# EAGLE board CrowBot -V1.4-20220909 (EAGLE 9.5.1), part 1 of 2
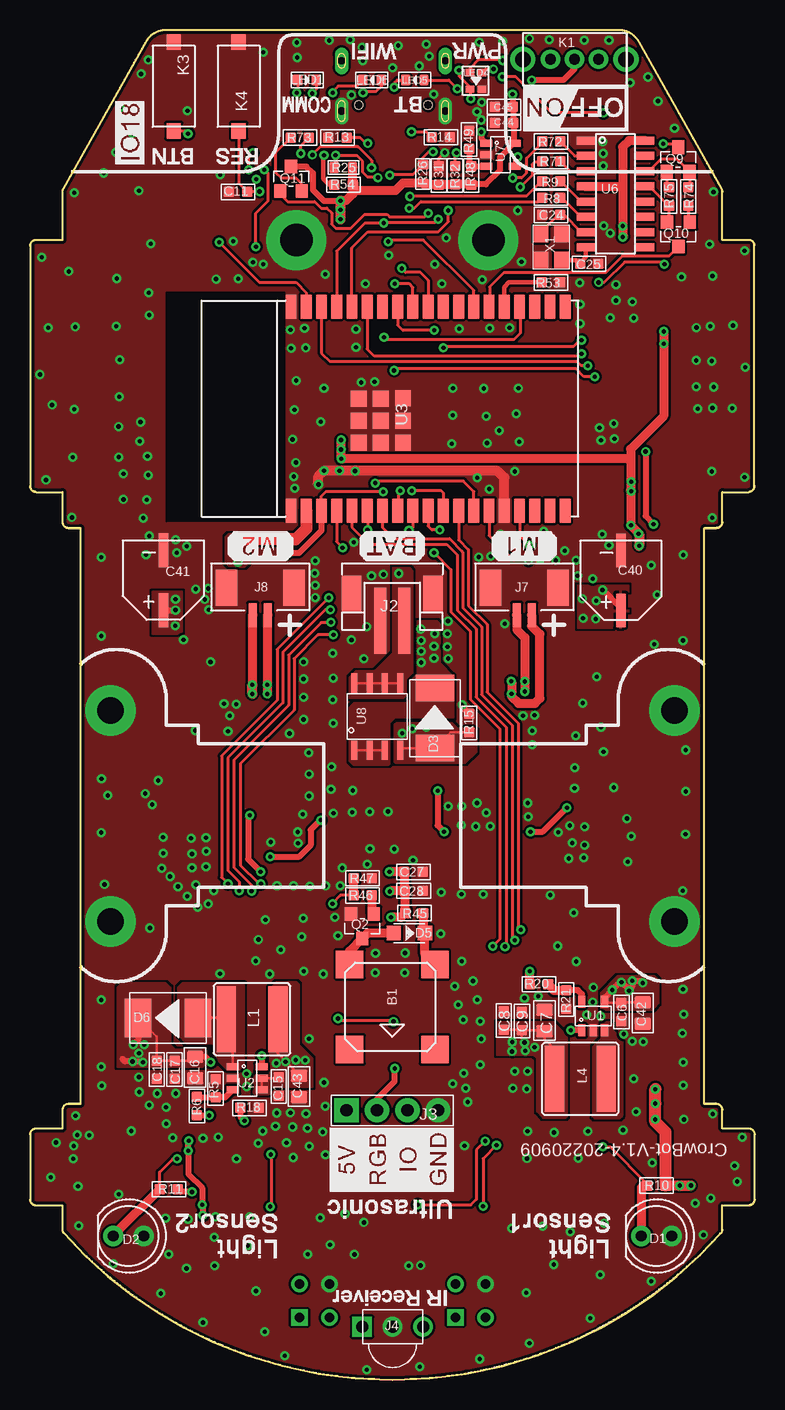
[diagram p5: board, top side]
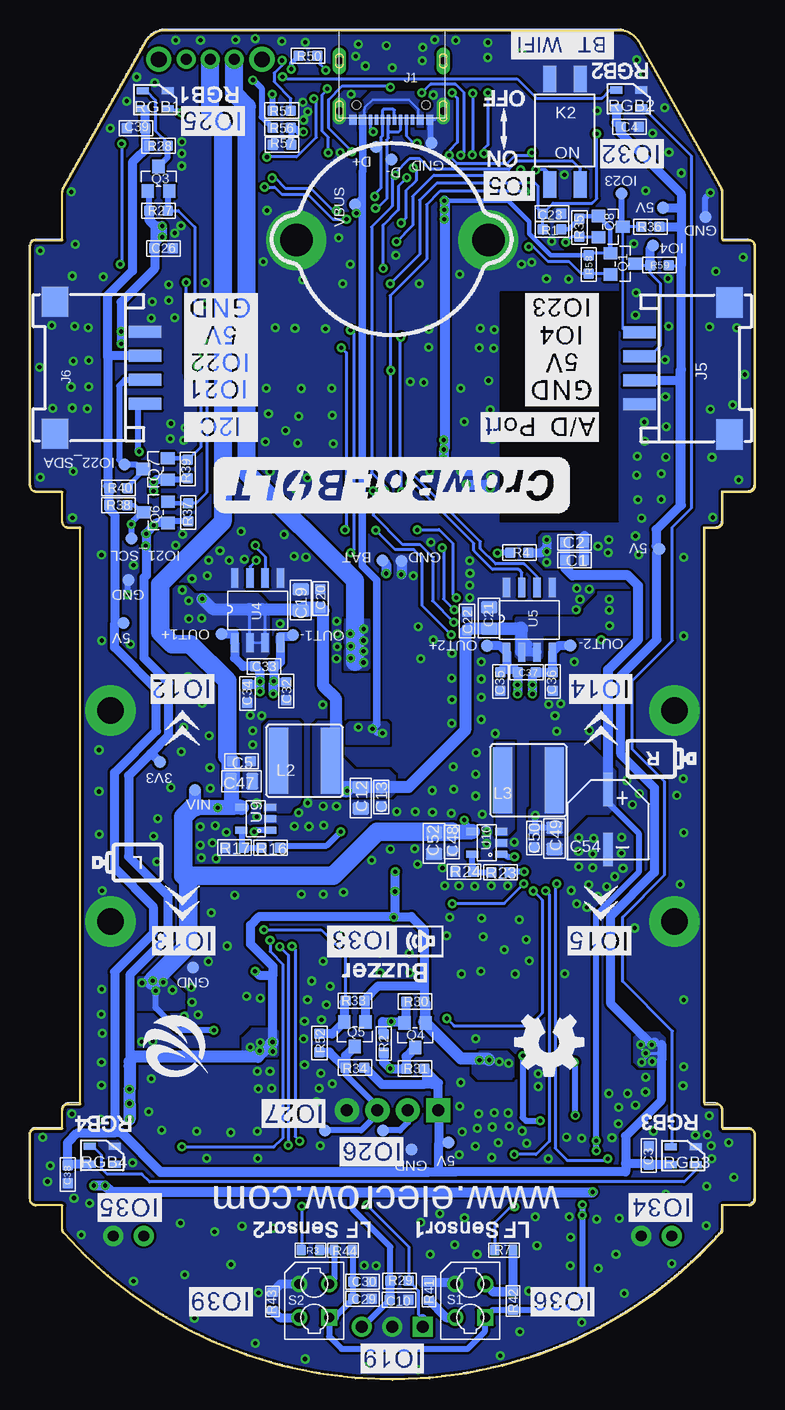
[diagram p6: board, bottom side, seen from below]

Size 60.4 x 112.49 mm. Coordinates in mm from the lower left corner, seen from the top.
Outline: 9.63,111.47 2.76,99.24 arc29 2.7,99 2.7,94.99 0.5,94.99 arc90 0,94.49 0,74.49 arc90 0.5,73.99 2.7,73.99 2.7,71.49 arc90 3.2,70.99 4.2,70.99 4.2,22.99 3.2,22.99 arc90 2.7,22.49 2.7,20.94 0.5,20.94 arc90 0,20.44 0,15.04 arc90 0.5,14.54 2.7,14.54 2.7,12.54 arc35 2.79,12.24 arc24 15.19,3.2 arc48 45.2,3.19 arc24 57.61,12.25 arc35 57.7,12.54 57.7,14.54 59.9,14.54 arc90 60.4,15.04 60.4,20.44 arc90 59.9,20.94 57.7,20.94 57.7,22.49 arc90 57.2,22.99 56.2,22.99 56.2,70.99 57.2,70.99 arc90 57.7,71.49 57.7,73.99 59.9,73.99 arc90 60.38,74.52 60.38,94.52 arc90 59.9,94.99 57.7,94.99 57.7,99 arc29 57.64,99.24 50.77,111.47 arc61 49.03,112.49 11.37,112.49 arc61 9.63,111.47
Copper layers (1*16): Top 0.035mm / dielectric 1.5mm / Bottom 0.035mm
Design rules "default *": minimum track width 6mil, minimum drill 0.35mm, track to track 8mil, track to pad 7mil, pad to pad 7mil, via to via 8mil, smd to smd 8mil, copper to edge 10mil, drill to drill 8mil, minimum pad ring 10mil, minimum via ring 8mil, stop-mask expansion 4mil, vias tented up to drill 100mil, thermal gap 10mil
Net classes: 0 default: width 0.203 mm, drill 0.178 mm, clearance 0.178 mm
tRestrict: area 11.4,71.5 to 21.2,90.6
bRestrict: area 11.4,71.5 to 21.2,90.6

## Footprints (pad centres in the part's own frame; a part is rotated, then mirrored left to right if it is on the bottom)
MLT-8530 = smd 2.3 x 2.3: 1 -3.55,3.55; 2 -3.55,-3.55; 3 3.55,-3.55; 4 3.55,3.55
DISCRETE_C0603 = smd 0.889 x 0.889: 1 -0.762,0; 2 0.762,0
0603 = smd 0.889 x 0.889: 1 -0.762,0; 2 0.762,0
0805 = smd 1.016 x 1.397: 1 -0.889,0; 2 0.889,0
CAP_220UF_SMD_6.3*5.4MM = smd 0.8 x 2.8: 1+ 0,2.5; 2- 0,-2.5
CAP-100UF-SMD-6.3*4.5MM = smd 0.8 x 2.8: 1+ 0,2.5; 2- 0,-2.5
LIGHT-PD-F5MM = drill 0.9 pad 1.676: 1 -1.27,0; 2 1.27,0
214AB = smd 2.2 x 3.2: 1 -2.5,0; 2 2.5,0
SOD-323 = smd 1.2 x 1.2: 1 1.3,0; 2 -1.3,0
TYPEC-3.0-16P-SMD = smd 0.3 x 0.85: A1 -3.35,0; A4 -2.55,0; A5 -1.25,0; A6 -0.25,0; A7 0.25,0; A8 -1.75,0; A9 2.55,0; A12 3.35,0; B1 3.05,0; B4 2.25,0; B5 1.75,0; B6 0.75,0; B7 -0.75,0; B8 1.25,0; B9 -2.25,0; B12 -3.05,0 | drill 0.6 pad 1.016 long: P$1 -4.325,-0.72; P$2 4.325,-0.72; P$3 -4.325,-4.9; P$4 4.325,-4.9 | hole 0.68: -2.89,-1.22; 2.89,-1.22
PH2.0_2P = smd 1 x 5.5: 1 -1,2.75; 2 1,2.75 | smd 1.6 x 3: 3 -3.4,0.5; 4 3.4,0.5
4P-2.54-80/40MIL = drill 1.016 pad 2.032 square: 1 0,3.81 | drill 1.016 pad 2.032: 2 0,1.27; 3 0,-1.27; 4 0,-3.81
3P-2.54-4.8X5X6.95H = drill 1 pad 1.65 square: 1 -2.54,0 | drill 1 pad 1.65: 2 0,0; 3 2.54,0
CONNECTOR_4P-SMD-2.0-90D = smd 1.01 x 2.74: 1 -3,-0.1; 2 -1,-0.1; 3 1,-0.1; 4 3,-0.1 | smd 2.54 x 2.184: SS1 -5.5,7.4; SS2 5.5,7.4
CROWBOT-V1.0库_1.25MM-2PIN = smd 0.7 x 2: 1+ -0.625,2.3; 2 0.625,2.3 | smd 1.8 x 3: 3 -2.8,0; 4 2.8,0
SWITCH-8.9*6.9*4.7MM = drill 0.9 pad 1.6: 1 -2.01,0; 2 -0.01,0; 3 1.99,0 | drill 1.3 pad 2.1: P$1 -4.31,0; P$2 4.29,0
KEY_BM_4PIN = smd 1.1 x 2.2: 1 -1.27,3.81; 2 -1.27,-4.99; 3 1.27,3.81; 4 1.27,-4.99
CROWBOT-V1.1库_KEY_EN_2PIN_B/W = smd 1.3 x 1.2: 1 -3.7,0; 2 3.7,0
CD54 = smd 5.5 x 1.6: 1 0,2.159; 2 0,-2.159
DISCRETE_LED-0603 = smd 0.762 x 0.889: + -0.762,0; - 0.762,0
LED_BOTH_RED_BLUE_SMD_1.6*1.6*0.6MM = smd 0.6 x 0.7: 1 -0.635,0.635; 2 0.765,0.635; 3 -0.635,-0.365; 4 0.765,-0.365
PAD-1.0MM = smd 1 x 1: P$1 0,0
SOT23 = smd 1.016 x 1.143: 1 -0.889,-1.016; 2 0.889,-1.016; 3 0,1.016
SOT23@1 = smd 1.016 x 1.143: 1 -0.95,-1.016; 2 0.95,-1.016; 3 0,1.016
DISCRETE_R0603 = smd 0.889 x 0.889: 1 -0.762,0; 2 0.762,0
0603_S = smd 0.762 x 0.889: 1 -0.762,0; 2 0.762,0
R0603 = smd 0.889 x 0.889: 1 -0.762,0; 2 0.762,0
LED-RGB-4P-SMD-2427 = smd 1 x 0.6: 1_DOUT 1,-0.7; 2_GND 1,0.8; 3_DIN -1.1,0.8; 4_VCC -1.1,-0.7
4P-6.4X4.9X6.5H = drill 0.8 pad 1.35 square: 1 -1.4,-1.25 | drill 0.8 pad 1.35: 2 -1.4,1.25; 3 1.4,-1.25; 4 1.4,1.25
A_XBJ_SOT23-5 = smd 0.6 x 1: 1 -0.95,-1.2; 2 0,-1.2; 3 0.95,-1.2; 4 0.95,1.2; 5 -0.95,1.2
A_XBJ_SOT23-6 = smd 0.6 x 1: 1 -0.95,-1.2; 2 0,-1.2; 3 0.95,-1.2; 4 0.95,1.2; 5 0,1.2; 6 -0.95,1.2
ESP32-WROVER-B = smd 2 x 0.9: 1 -8.5,23.96; 2 -8.5,22.69; 3 -8.5,21.42; 4 -8.5,20.15; 5 -8.5,18.88; 6 -8.5,17.61; 7 -8.5,16.34; 8 -8.5,15.07; 9 -8.5,13.8; 10 -8.5,12.53; 11 -8.5,11.26; 12 -8.5,9.99; 13 -8.5,8.72; 14 -8.5,7.45; 15 -8.5,6.18; 16 -8.5,4.91; 17 -8.5,3.64; 18 -8.5,2.37; 19 -8.5,1.1; 20 8.5,1.1; 21 8.5,2.37; 22 8.5,3.64; 23 8.5,4.91; 24 8.5,6.18; 25 8.5,7.45; 26 8.5,8.72; 27 8.5,9.99; 28 8.5,11.26; 29 8.5,12.53; 30 8.5,13.8; 31 8.5,15.07; 32 8.5,16.34; 33 8.5,17.61; 34 8.5,18.88; 35 8.5,20.15; 36 8.5,21.42; 37 8.5,22.69; 38 8.5,23.96 | smd 1.33 x 1.33: 39 -2.835,18.295; 40 -1,18.295; 41 0.835,18.295; 42 -2.835,16.46; 43 -1,16.46; 44 0.835,16.46; 45 -2.835,14.625; 46 -1,14.625; 47 0.85,14.625
L9110S/SOP8 = smd 0.61 x 1.6: 1 -1.905,-2.7; 2 -0.635,-2.7; 3 0.635,-2.7; 4 1.905,-2.7; 5 1.905,2.7; 6 0.635,2.7; 7 -0.635,2.7; 8 -1.905,2.7
SOP-16 = smd 0.66 x 1.5: 1 -4.445,-2.475; 2 -3.175,-2.475; 3 -1.905,-2.475; 4 -0.635,-2.475; 5 0.635,-2.475; 6 1.905,-2.475; 7 3.175,-2.475; 8 4.445,-2.475; 9 4.445,2.475; 10 3.175,2.475; 11 1.905,2.475; 12 0.635,2.475; 13 -0.635,2.475; 14 -1.905,2.475; 15 -3.175,2.475; 16 -4.445,2.475
ME321AM5G-SOT23-5 = smd 0.6 x 1: 1 -0.95,-1.2; 2 0,-1.2; 3 0.95,-1.2; 4 0.95,1.2; 5 -0.95,1.2
SOP8 = smd 0.5 x 1.6: P$1 -1.905,-2.8; P$2 -0.635,-2.8; P$3 0.635,-2.8; P$4 1.905,-2.8; P$5 1.905,2.8; P$6 0.635,2.8; P$7 -0.635,2.8; P$8 -1.905,2.8
SMD3225 = smd 1.4 x 1.2: 1 -1.1,-0.85; 2 1.1,-0.85; 3 1.1,0.85; 4 -1.1,0.85

## Placement (x,y rotation side)
B1  MLT-8530  [MLT-8530]  30.19,31.08 270 top
C1  10uF  [DISCRETE_C0603]  15.03,68.32 180 bottom
C2  100nF  [DISCRETE_C0603]  15.03,69.79 180 bottom
C3  1uF  [DISCRETE_C0603]  8.83,18.69 270 bottom
C4  1uF  [DISCRETE_C0603]  10.43,104.44 180 bottom
C5  1uF  [0603]  42.77,51.55 180 bottom
C6  1uF  [0603]  49.29,30.65 90 top
C7  22uF  [0805]  42.88,29.94 270 top
C8  1uF  [0603]  39.48,29.94 270 top
C9  100nF  [0603]  41,29.92 270 top
C10  100nF  [DISCRETE_C0603]  29.65,6.69 180 bottom
C11  4.7uF  [0603]  17.34,98.99 180 top
C12  22uF  [0805]  32.84,48.51 90 bottom
C13  1uF  [0603]  31.13,48.56 90 bottom
C15  1uF  [0603]  20.74,24.45 90 top
C16  22uF  [0805]  13.76,26.03 90 top
C17  1uF  [0603]  12.04,25.85 90 top
C18  100nF  [0603]  10.56,25.85 90 top
C19  22uF  [0805]  37.83,64.99 270 bottom
C20  100nF  [DISCRETE_C0603]  36.2,65.12 270 bottom
C21  22uF  [0805]  22.14,63.49 270 bottom
C22  100nF  [DISCRETE_C0603]  23.98,63.24 270 bottom
C23  100nF  [DISCRETE_C0603]  16.9,97.2 180 bottom
C24  20pF  [0603]  43.43,97.09 0 top
C25  20pF  [0603]  46.6,93.02 180 top
C26  100nF  [0603]  49.28,94.29 0 bottom
C27  1uF  [DISCRETE_C0603]  31.95,42.33 180 top
C28  100nF  [DISCRETE_C0603]  31.98,40.76 180 top
C29  1uF  [DISCRETE_C0603]  32.7,6.77 180 bottom
C30  1uF  [DISCRETE_C0603]  32.7,8.17 180 bottom
C31  100nF  [DISCRETE_C0603]  34.08,100.38 270 top
C32  1uF  [0603]  39.05,57.4 90 bottom
C33  1uF  [0603]  40.88,59.45 180 bottom
C34  1uF  [0603]  42.28,57.19 90 bottom
C35  1uF  [0603]  21.2,58.21 90 bottom
C36  1uF  [0603]  16.83,58.21 90 bottom
C37  1uF  [0603]  19.01,58.97 180 bottom
C38  1uF  [DISCRETE_C0603]  57.26,17.14 90 bottom
C39  1uF  [DISCRETE_C0603]  51.56,104.31 0 bottom
C40  220UF/16V  [CAP_220UF_SMD_6.3*5.4MM]  49.24,66.62 180 top
C41  220UF/16V  [CAP_220UF_SMD_6.3*5.4MM]  11.11,66.64 180 top
C42  22uF  [0805]  51.07,30.57 90 top
C43  22uF  [0805]  22.42,24.45 90 top
C44  1uF  [DISCRETE_C0603]  39.51,104.77 0 top
C45  10uF  [DISCRETE_C0603]  39.48,106.09 0 top
C47  22uF  [0805]  42.77,49.88 180 bottom
C48  1uF  [0603]  25.26,44.82 90 bottom
C49  22uF  [0805]  16.7,45.13 90 bottom
C50  1uF  [0603]  18.37,45.15 90 bottom
C52  22uF  [0805]  26.73,44.72 90 bottom
C54  100uF  [CAP-100UF-SMD-6.3*4.5MM]  12.23,46.7 0 bottom
D1  LIGHT-PD-F5MM  [LIGHT-PD-F5MM]  52.2,11.99 0 top
D2  LIGHT-PD-F5MM  [LIGHT-PD-F5MM]  8.2,11.99 0 top
D3  S2M/SMB  [214AB]  33.75,55.15 90 top
D5  1N5819WS  [SOD-323]  31.61,37.23 0 top
D6  SS34B/SMB  [214AB]  11.51,30.17 180 top
J1  [TYPEC-3.0-16P-SMD]  30.29,105.02 180 bottom
J2  [PH2.0_2P]  30.19,66.03 180 top
J3  [4P-2.54-80/40MIL]  30.19,22.47 90 top
J4  [3P-2.54-4.8X5X6.95H]  30.21,4.43 0 top
J5  [CONNECTOR_4P-SMD-2.0-90D]  9.51,84.3 270 bottom
J6  [CONNECTOR_4P-SMD-2.0-90D]  50.92,84.35 90 bottom
J7  1.25MM-2PIN  [CROWBOT-V1.0库_1.25MM-2PIN]  41.19,66.03 180 top
J8  1.25MM-2PIN  [CROWBOT-V1.0库_1.25MM-2PIN]  19.19,66.03 180 top
K1  SWITCH-8.96.9*4.7MM  [SWITCH-8.9*6.9*4.7MM]  45.38,110.05 0 top
K2  KEY_BM_4PIN  [KEY_BM_4PIN]  15.81,103.42 180 bottom
K3  CROWBOT-V1.1库_KEY_EN_2PIN_B/W  [CROWBOT-V1.1库_KEY_EN_2PIN_B/W]  11.98,107.79 270 top
K4  CROWBOT-V1.1库_KEY_EN_2PIN_B/W  [CROWBOT-V1.1库_KEY_EN_2PIN_B/W]  17.39,107.79 270 top
L1  5.6UH  [CD54]  18.5,30.04 270 top
L2  5.6UH  [CD54]  37.53,51.58 90 bottom
L3  5.6UH  [CD54]  18.86,49.95 90 bottom
L4  5.6UH  [CD54]  45.86,25.09 270 top
LED1  BLUE  [DISCRETE_LED-0603]  23.08,108.32 0 top
LED4  LED_BOTH_RED_BLUE  [LED_BOTH_RED_BLUE_SMD_1.6*1.6*0.6MM]  37.05,108.32 270 top
LED5  BLUE  [DISCRETE_LED-0603]  32.08,108.32 180 top
LED6  BLUE  [DISCRETE_LED-0603]  28.49,108.32 180 top
P1  PADPAD-1.0MM  [PAD-1.0MM]  7.96,69.23 0 bottom
P2  PADPAD-1.0MM  [PAD-1.0MM]  49.57,51.5 0 bottom
P3  PADPAD-1.0MM  [PAD-1.0MM]  46.65,49.17 0 bottom
P4  PADPAD-1.0MM  [PAD-1.0MM]  31.03,68.27 0 bottom
P5  PADPAD-1.0MM  [PAD-1.0MM]  25.54,19.78 0 bottom
P6  PADPAD-1.0MM  [PAD-1.0MM]  44.44,62.15 0 bottom
P7  PADPAD-1.0MM  [PAD-1.0MM]  38.49,62.07 0 bottom
P8  PADPAD-1.0MM  [PAD-1.0MM]  22.31,61.18 0 bottom
P9  PADPAD-1.0MM  [PAD-1.0MM]  15.38,61.21 0 bottom
P10  PADPAD-1.0MM  [PAD-1.0MM]  33.31,97.96 0 bottom
P11  PADPAD-1.0MM  [PAD-1.0MM]  31.56,102.76 0 bottom
P12  PADPAD-1.0MM  [PAD-1.0MM]  30.29,101.72 0 bottom
P13  PADPAD-1.0MM  [PAD-1.0MM]  26.94,103.06 0 bottom
P14  PADPAD-1.0MM  [PAD-1.0MM]  35.8,20.79 0 bottom
P15  PADPAD-1.0MM  [PAD-1.0MM]  30.97,20.79 0 bottom
P16  PADPAD-1.0MM  [PAD-1.0MM]  29.45,68.24 0 bottom
P17  PADPAD-1.0MM  [PAD-1.0MM]  11.11,98.85 0 bottom
P18  PADPAD-1.0MM  [PAD-1.0MM]  52.54,76.27 0 bottom
P19  PADPAD-1.0MM  [PAD-1.0MM]  51.96,70.12 0 bottom
P20  PADPAD-1.0MM  [PAD-1.0MM]  28.61,19.19 0 bottom
P21  PADPAD-1.0MM  [PAD-1.0MM]  4.13,96.92 0 bottom
P22  PADPAD-1.0MM  [PAD-1.0MM]  7.66,97.68 0 bottom
P23  PADPAD-1.0MM  [PAD-1.0MM]  46.8,34.36 0 bottom
P24  PADPAD-1.0MM  [PAD-1.0MM]  52.18,66.64 0 bottom
P25  PADPAD-1.0MM  [PAD-1.0MM]  52.59,63.06 0 bottom
P26  PADPAD-1.0MM  [PAD-1.0MM]  8.5,94.53 0 bottom
Q1  2N7002  [SOT23]  11.01,93.01 270 bottom
Q2  S9013  [SOT23@1]  27.7,37.81 180 top
Q3  2N7002  [SOT23]  49.69,100.1 0 bottom
Q4  2N7002/NC  [SOT23]  28.3,28.72 180 bottom
Q5  2N7002/NC  [SOT23]  33.33,28.8 180 bottom
Q6  2N7002  [SOT23]  49.91,72.3 90 bottom
Q7  2N7002  [SOT23]  49.94,75.91 90 bottom
Q8  2N7002  [SOT23]  12.02,96.1 270 bottom
Q9  S9013  [SOT23@1]  54.01,101.7 0 top
Q10  S9013  [SOT23@1]  54.04,95.47 180 top
Q11  2N7002  [SOT23]  21.75,100.09 0 top
R1  10K  [DISCRETE_R0603]  16.9,95.88 180 bottom
R2  0R  [DISCRETE_R0603]  30.92,28.03 270 bottom
R3  0R  [0603_S]  37.02,10.81 180 bottom
R4  10K  [R0603]  19.63,68.95 180 bottom
R5  10K  [DISCRETE_R0603]  15.46,24.3 90 top
R6  73.2K  [DISCRETE_R0603]  13.91,22.83 90 top
R7  0R  [0603_S]  20.92,10.81 180 bottom
R8  22R  [DISCRETE_R0603]  43.43,98.51 0 top
R9  22R  [DISCRETE_R0603]  43.43,99.89 0 top
R10  5.1K  [DISCRETE_R0603]  52.21,16.2 0 top
R11  5.1K  [DISCRETE_R0603]  11.57,15.89 0 top
R13  5.1K  [DISCRETE_R0603]  25.63,103.53 0 top
R14  5.1K  [DISCRETE_R0603]  34.23,103.55 0 top
R15  10K  [DISCRETE_R0603]  36.61,54.74 270 top
R16  45.3K  [DISCRETE_R0603]  40.35,44.34 180 bottom
R17  10K  [DISCRETE_R0603]  43.37,44.37 180 bottom
R18  20K  [DISCRETE_R0603]  18.29,22.66 180 top
R20  45.3K  [DISCRETE_R0603]  42.41,32.97 0 top
R21  10K  [DISCRETE_R0603]  44.68,31.7 270 top
R23  45.3K  [DISCRETE_R0603]  21.2,42.31 180 bottom
R24  10K  [DISCRETE_R0603]  24.22,42.34 180 bottom
R25  10K  [0603_S]  26.12,101.02 0 top
R26  10K  [0603_S]  32.74,100.5 270 top
R27  4.7K  [DISCRETE_R0603]  49.69,97.43 0 bottom
R28  4.7K  [DISCRETE_R0603]  49.69,102.85 0 bottom
R29  10K  [DISCRETE_R0603]  29.6,8.25 0 bottom
R30  4.7K/NC  [DISCRETE_R0603]  28.3,31.53 180 bottom
R31  4.7K/NC  [DISCRETE_R0603]  28.3,25.95 180 bottom
R32  1K  [DISCRETE_R0603]  35.42,100.38 270 top
R33  4.7K/NC  [DISCRETE_R0603]  33.33,31.6 180 bottom
R34  4.7K/NC  [DISCRETE_R0603]  33.33,26.03 180 bottom
R35  4.7K  [DISCRETE_R0603]  14.62,96.02 270 bottom
R36  4.7K  [DISCRETE_R0603]  8.71,96.09 180 bottom
R37  4.7K  [DISCRETE_R0603]  47.22,72.3 90 bottom
R38  4.7K  [DISCRETE_R0603]  53.04,72.9 0 bottom
R39  4.7K  [DISCRETE_R0603]  47.25,75.91 90 bottom
R40  4.7K  [DISCRETE_R0603]  53.02,74.32 0 bottom
R41  300R  [0603_S]  27.14,7.38 270 bottom
R42  24K  [0603_S]  20.15,6.57 90 bottom
R43  300R  [0603_S]  40.2,6.54 270 bottom
R44  24K  [0603_S]  34.3,10.81 180 bottom
R45  5.1R  [R0603]  32.03,38.9 0 top
R46  2K  [DISCRETE_R0603]  27.72,40.38 0 top
R47  10K  [DISCRETE_R0603]  27.72,41.8 180 top
R48  10K  [R0603]  36.77,100.37 90 top
R49  24K  [R0603]  36.59,103.35 90 top
R50  5.1K  [DISCRETE_R0603]  37.22,110.35 180 bottom
R51  5.1K  [DISCRETE_R0603]  39.42,105.78 180 bottom
R52  0R  [DISCRETE_R0603]  36.28,28.08 270 bottom
R53  10K  [DISCRETE_R0603]  43.41,91.46 0 top
R54  1K  [DISCRETE_R0603]  26.14,99.59 0 top
R56  10K  [R0603]  39.42,104.33 0 bottom
R57  21K  [R0603]  39.4,102.94 180 bottom
R58  4.7K  [DISCRETE_R0603]  13.83,92.96 270 bottom
R59  4.7K  [DISCRETE_R0603]  7.94,92.9 180 bottom
R71  22R  [DISCRETE_R0603]  43.43,101.57 0 top
R72  22R  [DISCRETE_R0603]  43.43,103.21 0 top
R73  1K  [DISCRETE_R0603]  22.49,103.53 180 top
R74  1K  [DISCRETE_R0603]  54.85,98.62 90 top
R75  1K  [DISCRETE_R0603]  53.25,98.62 270 top
RGB1  LED-RGB-4P-2427  [LED-RGB-4P-SMD-2427]  49.92,106.64 0 bottom
RGB2  LED-RGB-4P-2427  [LED-RGB-4P-SMD-2427]  10.45,106.7 0 bottom
RGB3  LED-RGB-4P-2427  [LED-RGB-4P-SMD-2427]  5.91,18.64 0 bottom
RGB4  LED-RGB-4P-2427  [LED-RGB-4P-SMD-2427]  54.34,18.66 0 bottom
S1  RPR220（右边）  [4P-6.4X4.9X6.5H]  23.71,6.6 90 bottom
S2  RPR220(左边）  [4P-6.4X4.9X6.5H]  36.72,6.6 90 bottom
U1  HM3416H  [A_XBJ_SOT23-5]  46.93,30.32 0 top
U2  HM1548C  [A_XBJ_SOT23-6]  18.1,25.14 270 top
U3  ESP32-WROVER-B  [ESP32-WROVER-B]  45.71,80.94 90 top
U4  L9110S/SOP8  [L9110S/SOP8]  41.44,64.13 0 bottom
U5  L9110S/SOP8  [L9110S/SOP8]  18.78,63.34 0 bottom
U6  CH340G  [SOP-16]  48.78,98.83 270 top
U7  ME321AM5G-SOT23-5  [ME321AM5G-SOT23-5]  39.2,102.1 270 top
U8  AO4407A_PMOS  [SOP8]  28.94,55.27 0 top
U9  HM3416H  [A_XBJ_SOT23-5]  41.59,46.77 90 bottom
U10  HM3416H  [A_XBJ_SOT23-5]  22.34,44.75 90 bottom
U$3  [SIG_TOP]  75.15,133.29 180 top  (outside the outline)
U$4  [SIG_BOTTOM]  76.77,133.34 180 top  (outside the outline)
U$30  [ELECROW-NEW]  45.52,30.39 180 bottom
U$56  [OSHW_FILLX200_NOTEXT]  14.31,30.39 180 bottom
X1  12Mhz,20pF,10ppm  [SMD3225]  43.43,94.42 270 top